# Altium project Main.PrjPCB (part 2 of 2)
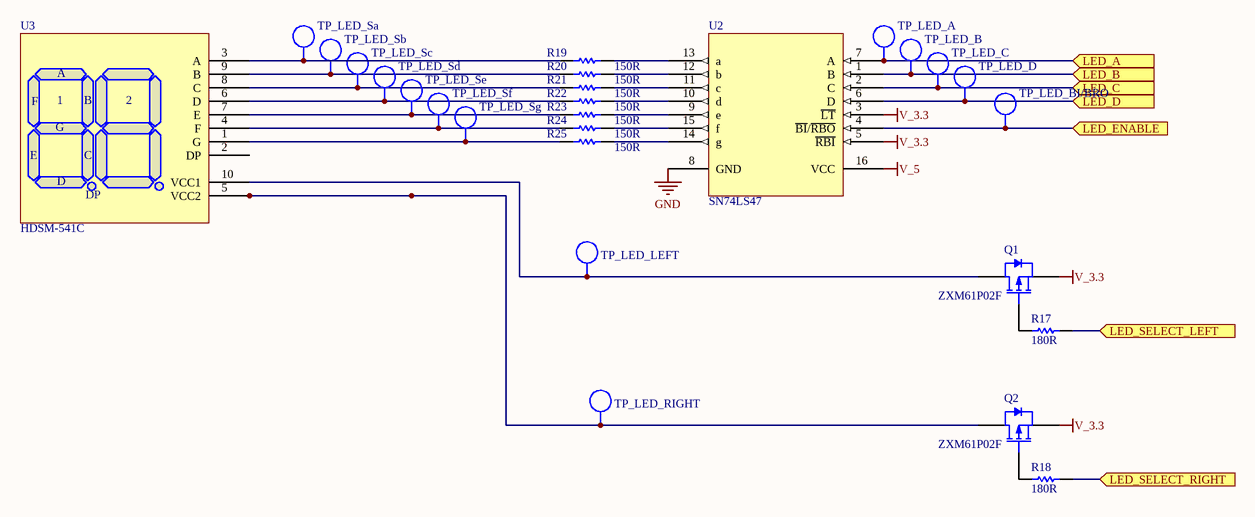
[diagram p8: LED_Display.SchDoc]

## Nets that join several sheets
GND: Main (8 pins), Other (22 pins), CAN (13 pins), USB (P2.5 R73.1 R74.1 R75.1), Power (47 pins), Sensors (6 pins), accelerator (10 pins), LED_Display (U2.8)
V_3.3: Main (6 pins), Other (12 pins), CAN (R37.1 R39.1), USB (Q3.3), Power (23 pins), Sensors (HLA_&_Speed.4), accelerator (C48.2 C49.2 U9.13), LED_Display (Q1.2 Q2.2 U2.3 U2.5)
V_5: Main (C42.2 U_SPI.19), CAN (C2.1 C3.1 U4.3), Power (7 pins), Sensors (5 pins), accelerator (P6.1 U9.3), LED_Display (U2.16)
V_12: Main (P_Act.7 P_Act.8), Power (6 pins), Sensors (HLA_&_Speed.5)
V_BATT: CAN (*#1.8 *#2.16), Power (12 pins)
ACC_PWM_5: Main (U_SPI.3), accelerator (P_PWM.1 TP_ACC_PWM.1)
ACC_SD_5: Main (U_SPI.1), accelerator (P_SD.1 TP_ACC_SD.1)
CAN_RXD: Main (U5.46), CAN (C4.2 TP_CAN_RXD.1 U4.4)
CAN_Status_A2: Main (U5.44), CAN (R38.1)
CAN_Status_B2: Main (U5.45), CAN (R40.1)
CAN_TXD: Main (U5.47), CAN (TP_CAN_TXD.1 U4.1)
LED_A: Main (U5.40), LED_Display (TP_LED_A.1 U2.7)
LED_B: Main (U5.41), LED_Display (TP_LED_B.1 U2.1)
LED_C: Main (U5.42), LED_Display (TP_LED_C.1 U2.2)
LED_D: Main (U5.43), LED_Display (TP_LED_D.1 U2.6)
LED_ENABLE: Main (U5.39), LED_Display (TP_LED_BI/BRO.1 U2.4)
LED_SELECT_LEFT: Main (U5.38), LED_Display (R17.2)
LED_SELECT_RIGHT: Main (U5.36), LED_Display (R18.2)
NetR71_1: Other (U5.93), USB (R71.1)
NetR72_1: Other (U5.94), USB (R72.1)
RST: Other (6 pins), Power (R63.1 U7.2)
Sensor_Encoder_Counter_1: Main (U5.69), Sensors (TP_En_Count_2.1 U1.7)
Sensor_Encoder_Counter_2: Main (U5.70), Sensors (TP_En_Count_1.1 U1.8)
Sensor_LA_Position: Main (U5.6), Sensors (HLA_&_Speed.2)
Sensor_Speed: Main (U5.71), Sensors (R67.1 R68.2 TP_Speed_L.1)
SPI0_MISO: Main (SPI0.3 TP_SPI0_MISO.1 U5.24), accelerator (U9.15)
SPI0_MOSI: Main (SPI0.2 TP_SPI0_MOSI.1 U5.25), accelerator (U9.14)
SPI0_NPCS0: Main (SPI0.7 TP_SPI0_CS0.1 U5.20), accelerator (U9.1)
SPI0_SPCK: Main (SPI0.1 TP_SPI0_SPCK.1 U5.26), accelerator (U9.16)
SW1: Main (U5.9 U5.35), Other (C44.2 R50.2 TP_S1.1)
SW2: Main (U5.54), Other (C45.2 R53.2 TP_S2.1)
SW3: Main (U5.75), Other (C46.2 R55.2 TP_S3.1)
USB_DISABLE: Main (U5.28), USB (Q3.1 TP_DISABLE.1)
USB_MONITOR: Main (U5.27), USB (R70.1 R73.2)